# Altium schematic sheet Buzzer.SchDoc
size A
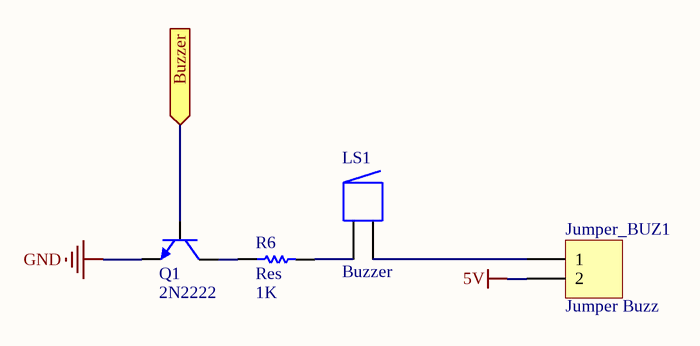
[diagram p0: Buzzer.SchDoc]

## Parts
Jumper_BUZ1  Jumper Buzz  [HDR1X2]
LS1  Buzzer  [BUZZER]
Q1  2N2222  [SOT-23]
R6  Res  value 1K  [2012[0805]]

## Ports
Buzzer (in)

## Nets
5V: Jumper_BUZ1.2
GND: Q1.3(E)
Buzzer: Q1.2(B) ; port Buzzer
NetJumper_BUZ1_1: Jumper_BUZ1.1 LS1.2
NetLS1_1: LS1.1 R6.2
NetQ1_1: Q1.1(C) R6.1

## Library data of the parts
Jumper_BUZ1 = Header 2: Header, 2-Pin; LatestRevisionDate: 17-Jul-2002; LatestRevisionNote: Re-released for DXP Platform.; Publisher: Altium Limited
LS1 = Buzzer: Magnetic Transducer Buzzer; Published: 24-Mar-1999; LatestRevisionDate: 17-Dec-2003; LatestRevisionNote: Schematic revised, PCB Footprint replaced.; DatasheetDocument: 17-Dec-2003; PackageReference: ABSM-1574; Publisher: Altium Limited; ComponentLink1Description: Manufacturer Link; ComponentLink1URL: http://www.megastar.com/linecard/buzzmode/index.php
Q1 = 2N2222: NPN Bipolar Transistor; Published: 8-Jun-2000; LatestRevisionDate: 17-Jul-2002; LatestRevisionNote: Re-released for DXP Platform.; PackageReference: TO-226; Publisher: Altium Limited; Code_JEDEC: TO-226-AA
R6 = Res: Semiconductor Resistor; Published: 8-Jun-2000; LatestRevisionDate: 17-Jul-2002; LatestRevisionNote: Re-released for DXP Platform.; PackageReference: AXIAL-0.5; Publisher: Altium Limited